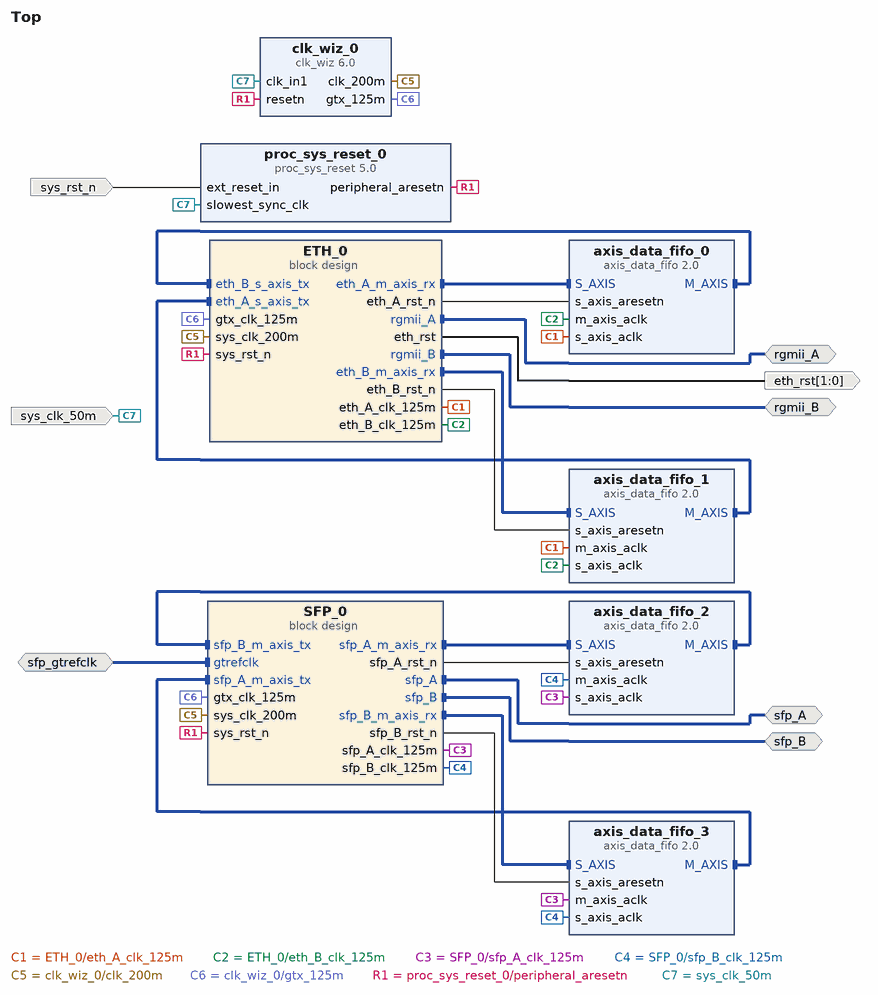
[diagram p0: block diagram of the top level]
# Vivado block design Top, xc7k325tffg676-2, Vivado 2023.1
create_bd_design Top

create_bd_intf_port -mode Master -vlnv xilinx.com:interface:rgmii_rtl:1.0 rgmii_A
create_bd_intf_port -mode Master -vlnv xilinx.com:interface:rgmii_rtl:1.0 rgmii_B
create_bd_intf_port -mode Slave -vlnv xilinx.com:interface:diff_clock_rtl:1.0 sfp_gtrefclk
create_bd_intf_port -mode Master -vlnv xilinx.com:interface:sfp_rtl:1.0 sfp_B
create_bd_intf_port -mode Master -vlnv xilinx.com:interface:sfp_rtl:1.0 sfp_A
create_bd_port -dir I -type clk sys_clk_50m
set_property -dict {CONFIG.ASSOCIATED_RESET sys_rst_n CONFIG.FREQ_HZ 50000000} [get_bd_ports sys_clk_50m]
create_bd_port -dir I -type rst sys_rst_n
set_property -dict {CONFIG.POLARITY ACTIVE_LOW} [get_bd_ports sys_rst_n]
create_bd_port -dir O -from 1 -to 0 eth_rst

create_bd_cell -type container -reference ETH ETH_0
set_property -dict [list \
  CONFIG.ACTIVE_SIM_BD ETH.bd \
  CONFIG.ACTIVE_SYNTH_BD ETH.bd \
  CONFIG.ENABLE_DFX 0 \
  CONFIG.LIST_SIM_BD ETH.bd \
  CONFIG.LIST_SYNTH_BD ETH.bd \
  CONFIG.LOCK_PROPAGATE 0 \
] [get_bd_cells ETH_0]
create_bd_cell -type ip -vlnv xilinx.com:ip:axis_data_fifo:2.0 axis_data_fifo_0
set_property -dict {CONFIG.IS_ACLK_ASYNC 1} [get_bd_cells axis_data_fifo_0]
create_bd_cell -type ip -vlnv xilinx.com:ip:axis_data_fifo:2.0 axis_data_fifo_1
set_property -dict {CONFIG.IS_ACLK_ASYNC 1} [get_bd_cells axis_data_fifo_1]
create_bd_cell -type ip -vlnv xilinx.com:ip:proc_sys_reset:5.0 proc_sys_reset_0
create_bd_cell -type ip -vlnv xilinx.com:ip:clk_wiz:6.0 clk_wiz_0
set_property -dict [list \
  CONFIG.CLKOUT1_JITTER 142.107 \
  CONFIG.CLKOUT1_REQUESTED_OUT_FREQ 200 \
  CONFIG.CLKOUT2_JITTER 154.207 \
  CONFIG.CLKOUT2_PHASE_ERROR 164.985 \
  CONFIG.CLKOUT2_REQUESTED_OUT_FREQ 125 \
  CONFIG.CLKOUT2_USED true \
  CONFIG.CLK_OUT1_PORT clk_200m \
  CONFIG.CLK_OUT2_PORT gtx_125m \
  CONFIG.MMCM_CLKOUT0_DIVIDE_F 5.000 \
  CONFIG.MMCM_CLKOUT1_DIVIDE 8 \
  CONFIG.NUM_OUT_CLKS 2 \
  CONFIG.RESET_PORT resetn \
  CONFIG.RESET_TYPE ACTIVE_LOW \
  CONFIG.USE_LOCKED false \
] [get_bd_cells clk_wiz_0]
create_bd_cell -type container -reference SFP SFP_0
set_property -dict [list \
  CONFIG.ACTIVE_SIM_BD SFP.bd \
  CONFIG.ACTIVE_SYNTH_BD SFP.bd \
  CONFIG.ENABLE_DFX 0 \
  CONFIG.LIST_SIM_BD SFP.bd \
  CONFIG.LIST_SYNTH_BD SFP.bd \
  CONFIG.LOCK_PROPAGATE 0 \
] [get_bd_cells SFP_0]
create_bd_cell -type ip -vlnv xilinx.com:ip:axis_data_fifo:2.0 axis_data_fifo_2
set_property -dict {CONFIG.IS_ACLK_ASYNC 1} [get_bd_cells axis_data_fifo_2]
create_bd_cell -type ip -vlnv xilinx.com:ip:axis_data_fifo:2.0 axis_data_fifo_3
set_property -dict {CONFIG.IS_ACLK_ASYNC 1} [get_bd_cells axis_data_fifo_3]

# ---- connections ----

connect_bd_intf_net [get_bd_intf_pins ETH_0/eth_A_m_axis_rx] [get_bd_intf_pins axis_data_fifo_0/S_AXIS]
connect_bd_intf_net [get_bd_intf_pins ETH_0/eth_B_m_axis_rx] [get_bd_intf_pins axis_data_fifo_1/S_AXIS]
connect_bd_intf_net [get_bd_intf_ports rgmii_A] [get_bd_intf_pins ETH_0/rgmii_A]
connect_bd_intf_net [get_bd_intf_ports rgmii_B] [get_bd_intf_pins ETH_0/rgmii_B]
connect_bd_intf_net [get_bd_intf_ports sfp_A] [get_bd_intf_pins SFP_0/sfp_A]
connect_bd_intf_net [get_bd_intf_pins SFP_0/sfp_A_m_axis_rx] [get_bd_intf_pins axis_data_fifo_2/S_AXIS]
connect_bd_intf_net [get_bd_intf_ports sfp_B] [get_bd_intf_pins SFP_0/sfp_B]
connect_bd_intf_net [get_bd_intf_pins axis_data_fifo_3/S_AXIS] [get_bd_intf_pins SFP_0/sfp_B_m_axis_rx]
connect_bd_intf_net [get_bd_intf_pins axis_data_fifo_0/M_AXIS] [get_bd_intf_pins ETH_0/eth_B_s_axis_tx]
connect_bd_intf_net [get_bd_intf_pins axis_data_fifo_1/M_AXIS] [get_bd_intf_pins ETH_0/eth_A_s_axis_tx]
connect_bd_intf_net [get_bd_intf_pins axis_data_fifo_2/M_AXIS] [get_bd_intf_pins SFP_0/sfp_B_m_axis_tx]
connect_bd_intf_net [get_bd_intf_pins axis_data_fifo_3/M_AXIS] [get_bd_intf_pins SFP_0/sfp_A_m_axis_tx]
connect_bd_intf_net -intf_net gtrefclk_0_1 [get_bd_intf_ports sfp_gtrefclk] [get_bd_intf_pins SFP_0/gtrefclk]
connect_bd_net [get_bd_pins ETH_0/eth_A_clk_125m] [get_bd_pins axis_data_fifo_0/s_axis_aclk] [get_bd_pins axis_data_fifo_1/m_axis_aclk]
connect_bd_net [get_bd_pins ETH_0/eth_A_rst_n] [get_bd_pins axis_data_fifo_0/s_axis_aresetn]
connect_bd_net [get_bd_pins ETH_0/eth_B_clk_125m] [get_bd_pins axis_data_fifo_0/m_axis_aclk] [get_bd_pins axis_data_fifo_1/s_axis_aclk]
connect_bd_net [get_bd_pins ETH_0/eth_B_rst_n] [get_bd_pins axis_data_fifo_1/s_axis_aresetn]
connect_bd_net [get_bd_pins ETH_0/eth_rst] [get_bd_ports eth_rst]
connect_bd_net [get_bd_pins SFP_0/sfp_A_clk_125m] [get_bd_pins axis_data_fifo_2/s_axis_aclk] [get_bd_pins axis_data_fifo_3/m_axis_aclk]
connect_bd_net [get_bd_pins SFP_0/sfp_A_rst_n] [get_bd_pins axis_data_fifo_2/s_axis_aresetn]
connect_bd_net [get_bd_pins SFP_0/sfp_B_clk_125m] [get_bd_pins axis_data_fifo_2/m_axis_aclk] [get_bd_pins axis_data_fifo_3/s_axis_aclk]
connect_bd_net [get_bd_pins SFP_0/sfp_B_rst_n] [get_bd_pins axis_data_fifo_3/s_axis_aresetn]
connect_bd_net [get_bd_pins clk_wiz_0/clk_200m] [get_bd_pins ETH_0/sys_clk_200m] [get_bd_pins SFP_0/sys_clk_200m]
connect_bd_net -net gtx_clk_125m_1 [get_bd_pins clk_wiz_0/gtx_125m] [get_bd_pins ETH_0/gtx_clk_125m] [get_bd_pins SFP_0/gtx_clk_125m]
connect_bd_net [get_bd_pins proc_sys_reset_0/peripheral_aresetn] \
  [get_bd_pins ETH_0/sys_rst_n] [get_bd_pins clk_wiz_0/resetn] [get_bd_pins SFP_0/sys_rst_n]
connect_bd_net [get_bd_ports sys_clk_50m] [get_bd_pins proc_sys_reset_0/slowest_sync_clk] [get_bd_pins clk_wiz_0/clk_in1]
connect_bd_net [get_bd_ports sys_rst_n] [get_bd_pins proc_sys_reset_0/ext_reset_in]

validate_bd_design
save_bd_design
